# Altium project Embeded_System.PrjPcb
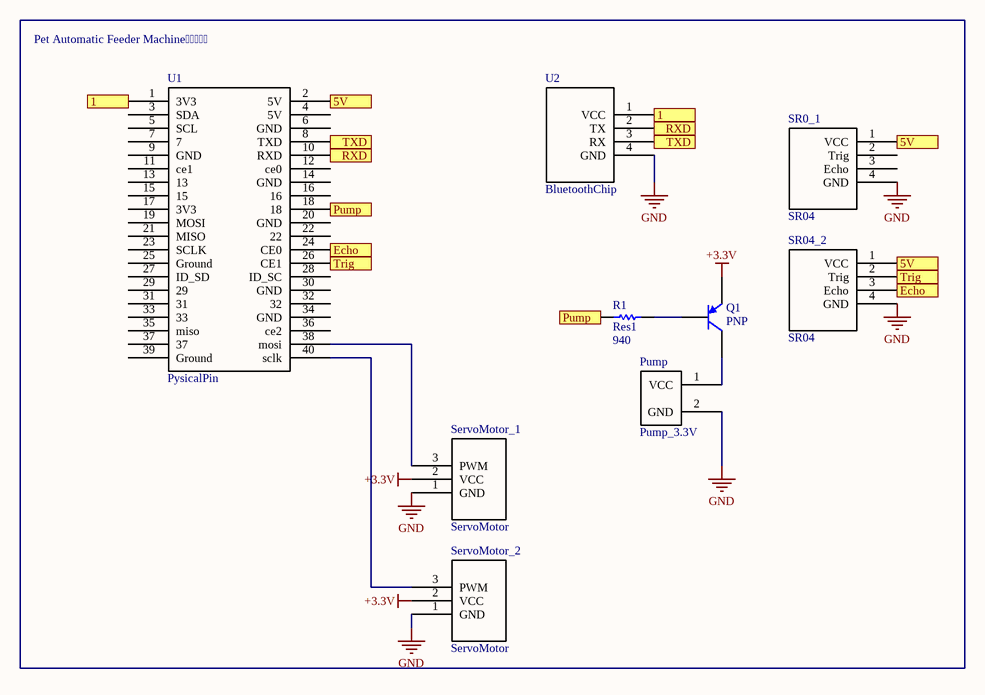
[diagram p0: PetAutomaticFeeder.SchDoc]
1 sheet, 9 parts. Net scope: flat (ports and power ports of the same name join across sheets).

## Sheet PetAutomaticFeeder.SchDoc
size A4; SheetNumber: 1; SheetTotal: 1

### Parts
Pump  Pump_3.3V
Q1  PNP  [SOT-23B_N]
R1  Res1  value 940  [AXIAL-0.3]
ServoMotor_1  ServoMotor
ServoMotor_2  ServoMotor
SR0_1  SR04
SR04_2  SR04
U1  PysicalPin
U2  BluetoothChip

### Ports
1, 5V, Echo, Pump, RXD, Trig, TXD

### Nets
+3.3V: Q1.3(E) ServoMotor_1.2(VCC) ServoMotor_2.2(VCC)
GND: Pump.2(GND) ServoMotor_1.1(GND) ServoMotor_2.1(GND) SR0_1.4(GND) SR04_2.4(GND) U2.4(GND)
NetPump_1: Pump.1(VCC) Q1.1(C)
NetQ1_2: Q1.2(B) R1.2
NetR1_1: R1.1 U1.18 ; port Pump
NetServoMotor_1_3: ServoMotor_1.3(PWM) U1.38(mosi)
NetServoMotor_2_3: ServoMotor_2.3(PWM) U1.40(sclk)
NetSR0_1_1: SR0_1.1(VCC) SR04_2.1(VCC) U1.2(5V) ; port 5V
NetSR04_2_2: SR04_2.2(Trig) U1.26(CE1) ; port Trig
NetSR04_2_3: SR04_2.3(Echo) U1.24(CE0) ; port Echo
NetU1_1: U1.1(3V3) U2.1(VCC) ; port 1
NetU1_8: U1.8(TXD) U2.3(RX) ; port TXD
NetU1_10: U1.10(RXD) U2.2(TX) ; port RXD

Not connected (* = marked no-connect by the designer): SR0_1 2(Trig) 3(Echo); U1 3(SDA) 4(5V) 5(SCL) 6(GND) 7 9(GND) 11(ce1) 12(ce0) 13 14(GND) 15 16 17(3V3) 19(MOSI) 20(GND) 21(MISO) 22 23(SCLK) 25(Ground) 27(ID_SD) 28(ID_SC) 29 30(GND) 31 32 33 34(GND) 35(miso) 36(ce2) 37 39(Ground)

### Notes on the sheet
- Pet Automatic Feeder Machine

### Library data of the parts
Pump = Pump
Q1 = PNP: PNP Bipolar Transistor; Published: 8-Jun-2000; LatestRevisionDate: 29-May-2009; LatestRevisionNote: IPC-7351 Footprint Added.; PackageVersion: Aug-1999; PackageReference: SOT-23B; Publisher: Altium Limited; PackageDescription: 3-Pin SOT-23 Package 0.95 mm Pitch, 2.4 mm Lead Span
R1 = Res1: Resistor; Published: 8-Jun-2000; LatestRevisionDate: 17-Jul-2002; LatestRevisionNote: Re-released for DXP Platform.; PackageReference: AXIAL-0.3; Publisher: Altium Limited; PackageDescription: Axial Device, Thru-Hole; 2 Leads; 0.3 in Pin Spacing
U1 = RespberryPi